# EAGLE design Esquema20 - Final (EAGLE 9.4.2)
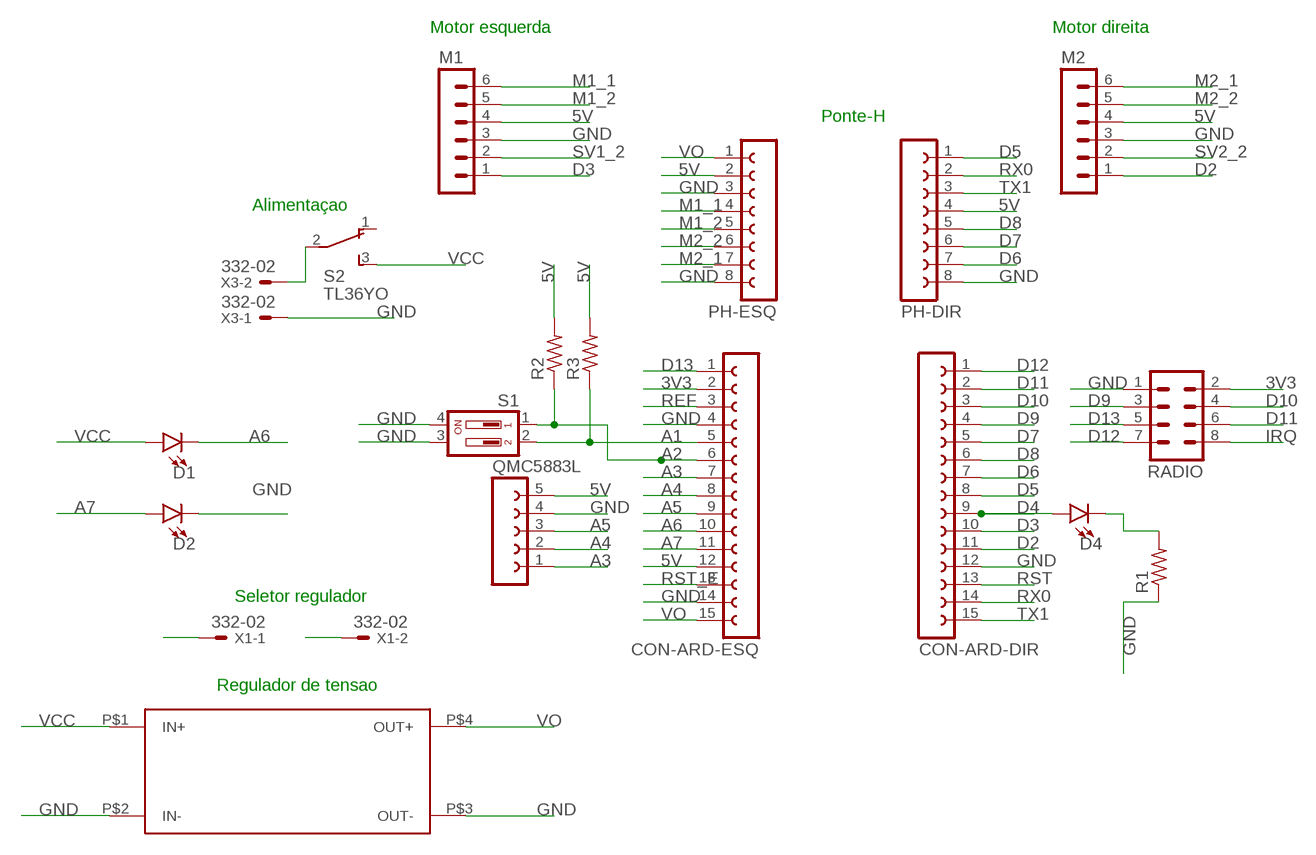
[diagram p0: schematic, sheet 1]

## Parts
CON-ARD-DIR  FE15-1  [FE15]
CON-ARD-ESQ  FE15-1  [FE15]
D1  LED-3MM-NO_SILK  [LED_3MM-NS]
D2  LED-3MM-NO_SILK  [LED_3MM-NS]
D4  LED-3MM-NO_SILK  [LED_3MM-NS]
M1  MA06-1  [MA06-1]
M2  MA06-1  [MA06-1]
PH-DIR  FE08-1  [FE08]
PH-ESQ  FE08-1  [FE08]
QMC5883L  FE05W  [FE05W]
R1  R-US_0207/12  [0207/12]
R2  R-US_0207/12  [0207/12]
R3  R-US_0207/12  [0207/12]
RADIO  MA04-2  [MA04-2]
S1  DA02  [DA-02]
S2  TL36YO  [TL3XYO]
U$1  REGULADOR  [REGULADOR-FP]
X1  332-02  [332-02]
X3  332-02  [332-02]

## Nets
3V3: CON-ARD-ESQ.2 RADIO.2
5V: CON-ARD-ESQ.12 M1.4 M2.4 PH-DIR.4 PH-ESQ.2 QMC5883L.5 R2.2 R3.2
A1: CON-ARD-ESQ.5 R3.1 S1.2
A2: CON-ARD-ESQ.6 R2.1 S1.1
A3: CON-ARD-ESQ.7 QMC5883L.1
A4: CON-ARD-ESQ.8 QMC5883L.2
A5: CON-ARD-ESQ.9 QMC5883L.3
A6: CON-ARD-ESQ.10 D1.K(C)
A7: CON-ARD-ESQ.11 D2.A
D2: CON-ARD-DIR.11 M2.1
D3: CON-ARD-DIR.10 M1.1
D4: CON-ARD-DIR.9 D4.A
D5: CON-ARD-DIR.8 PH-DIR.1
D6: CON-ARD-DIR.7 PH-DIR.7
D7: CON-ARD-DIR.5 PH-DIR.6
D8: CON-ARD-DIR.6 PH-DIR.5
D9: CON-ARD-DIR.4 RADIO.3
D10: CON-ARD-DIR.3 RADIO.4
D11: CON-ARD-DIR.2 RADIO.6
D12: CON-ARD-DIR.1 RADIO.7
D13: CON-ARD-ESQ.1 RADIO.5
GND: CON-ARD-DIR.12 CON-ARD-ESQ.4 CON-ARD-ESQ.14 D2.K(C) M1.3 M2.3 PH-DIR.8 PH-ESQ.3 PH-ESQ.8 QMC5883L.4 R1.1 RADIO.1 S1.3 S1.4 U$1.P$2(IN-) U$1.P$3(OUT-) X3.1
IRQ: RADIO.8
M1_1: M1.6 PH-ESQ.4
M1_2: M1.5 PH-ESQ.5
M2_1: M2.6 PH-ESQ.7
M2_2: M2.5 PH-ESQ.6
N$1: S2.2(P) X3.2
N$5: D4.K(C) R1.2
REF: CON-ARD-ESQ.3
RST: CON-ARD-DIR.13
RST_E: CON-ARD-ESQ.13
RX0: CON-ARD-DIR.14 PH-DIR.2
SV1_2: M1.2
SV2_2: M2.2
TX1: CON-ARD-DIR.15 PH-DIR.3
VCC [VCC]: D1.A S2.3(S) U$1.P$1(IN+) X1.1
VO: CON-ARD-ESQ.15 PH-ESQ.1 U$1.P$4(OUT+) X1.2
Unconnected: S2.1(O)

## Notes on the sheet
- Motor esquerda | Motor direita
- Ponte-H
- Alimentaçao
- Seletor regulador
- Regulador de tensao

## Library data of the parts
CON-ARD-DIR = con-lsta:FE15-1: FEMALE HEADER; OC_FARNELL: unknown; OC_NEWARK: unknown
CON-ARD-ESQ = con-lsta:FE15-1: FEMALE HEADER; OC_FARNELL: unknown; OC_NEWARK: unknown; SPICEPREFIX: X
D1 D2 D4 = SparkFun-LED:LED: LED (Generic) Standard schematic elements and footprints for 5mm, 3mm, 1206, and 0603 sized LEDs. Generic LEDs with no color specified.
M1 M2 = con-lstb:MA06-1: PIN HEADER; OC_FARNELL: unknown; OC_NEWARK: unknown
PH-DIR PH-ESQ = con-lsta:FE08-1: FEMALE HEADER; OC_FARNELL: unknown; OC_NEWARK: unknown
QMC5883L = con-lsta:FE05W: FEMALE HEADER; OC_FARNELL: unknown; OC_NEWARK: unknown
R1-R3 = resistor:R-US_: RESISTOR, American symbol
RADIO = con-lstb:MA04-2: PIN HEADER; OC_FARNELL: unknown; OC_NEWARK: unknown
S1 = switch-dil:DA02: DIL/CODE SWITCH; OC_FARNELL: 1255229; OC_NEWARK: unknown
S2 = switch:TL36YO: TINY SWITCH ON - ON Source: http://www2.produktinfo.conrad.com/datenblaetter/700000-724999/705152-da-01-de-Subminiaturschalter_TL_36YO.pdf
U$1 = robo-bdp:REGULADOR
X1 X3 = con-garry:332-02: 2 Pin - 2mm Dual Row Source: www.mpe-connector.de / garry_shortform_2012.pdf

## Net classes
0 default: width 1 mm
1 VCC: width 1 mm

## Board
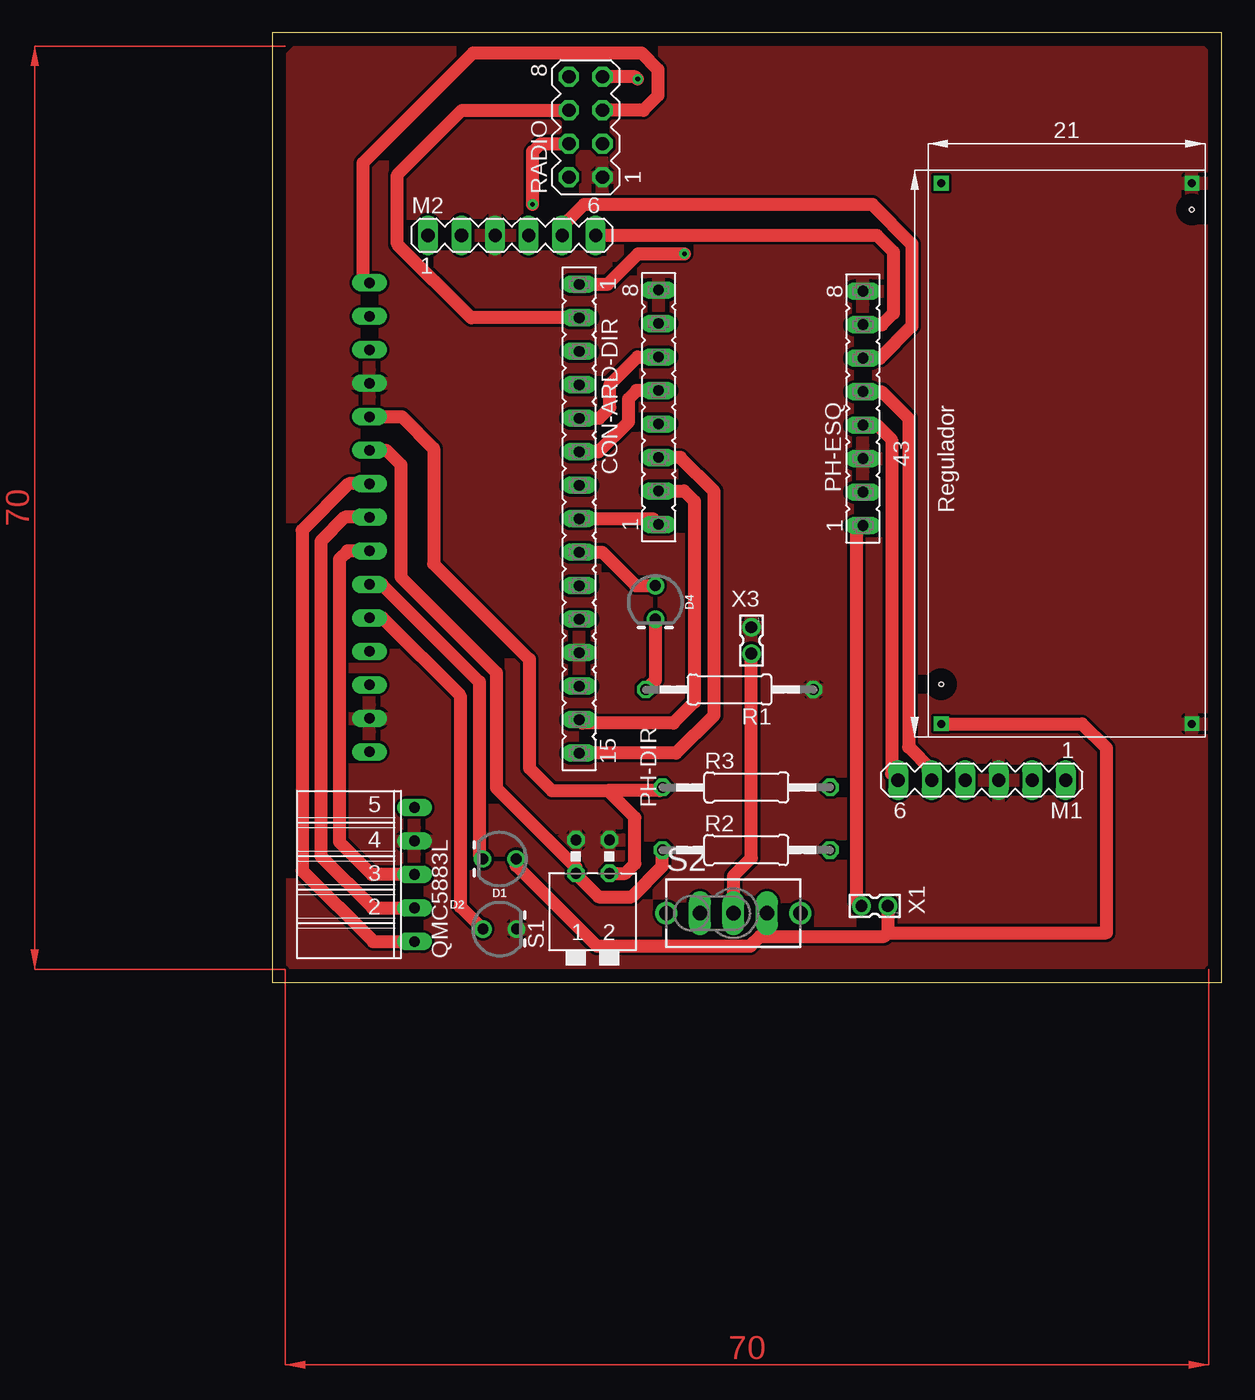
[diagram p1: board, top side]
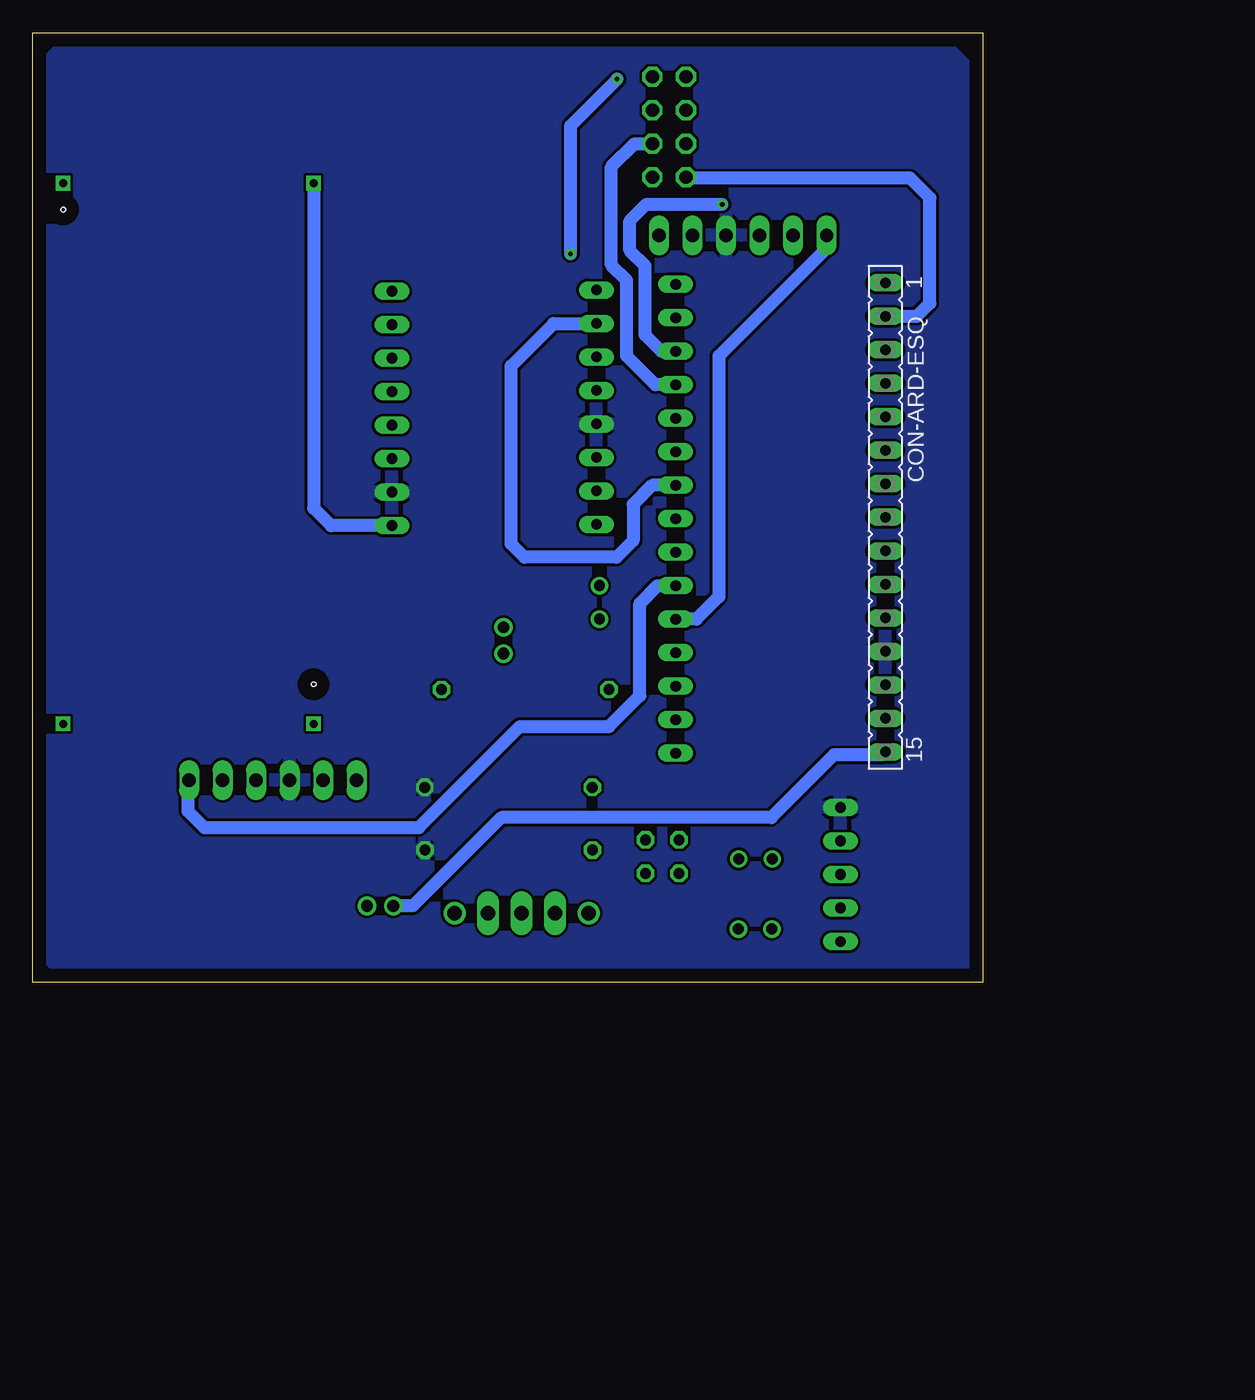
[diagram p2: board, bottom side, seen from below]

Size 72 x 72 mm. Coordinates in mm from the lower left corner, seen from the top.
Outline: 0,0 72,0 72,72 0,72 0,0
Copper layers (1*16): Top 0.035mm / dielectric 1.5mm / Bottom 0.035mm
Design rules "default *": minimum track width 6mil, minimum drill 0.35mm, track to track 8mil, track to pad 4mil, pad to pad 4mil, via to via 4mil, smd to smd 4mil, copper to edge 40mil, drill to drill 6mil, minimum pad ring 10mil, minimum via ring 8mil, stop-mask expansion 4mil, vias tented up to drill 0mil, thermal gap 10mil

### Footprints (pad centres in the part's own frame; a part is rotated, then mirrored left to right if it is on the bottom)
FE15 = drill 0.813 long: 1 -17.78,0; 2 -15.24,0; 3 -12.7,0; 4 -10.16,0; 5 -7.62,0; 6 -5.08,0; 7 -2.54,0; 8 0,0; 9 2.54,0; 10 5.08,0; 11 7.62,0; 12 10.16,0; 13 12.7,0; 14 15.24,0; 15 17.78,0
LED_3MM-NS = drill 0.813: A -1.27,0; K 1.27,0
MA06-1 = drill 1.016 long: 1 -6.35,0; 2 -3.81,0; 3 -1.27,0; 4 1.27,0; 5 3.81,0; 6 6.35,0
FE08 = drill 0.813 long: 1 -8.89,0; 2 -6.35,0; 3 -3.81,0; 4 -1.27,0; 5 1.27,0; 6 3.81,0; 7 6.35,0; 8 8.89,0
FE05W = drill 0.813 long: 1 -5.08,0; 2 -2.54,0; 3 0,0; 4 2.54,0; 5 5.08,0
0207/12 = drill 0.813 octagon: 1 -6.35,0; 2 6.35,0
MA04-2 = drill 1.016 octagon: 1 -3.81,-1.27; 2 -3.81,1.27; 3 -1.27,-1.27; 4 -1.27,1.27; 5 1.27,-1.27; 6 1.27,1.27; 7 3.81,-1.27; 8 3.81,1.27
DA-02 = drill 0.813 octagon: 1 -1.27,-1.27; 2 1.27,-1.27; 3 1.27,1.27; 4 -1.27,1.27
TL3XYO = drill 1.1 pad 1.422 long: 1 -2.54,0; 2 0,0; 3 2.54,0 | drill 1.1 pad 1.676: M1 -5.08,0; M2 5.08,0
REGULADOR-FP = drill 0.6 square: P$1 -19,3; P$2 -19,-16; P$3 22,-16; P$4 22,3 | hole 0.35: -16,3; 20,-16
332-02 = drill 0.9 pad 1.27: 1 0,-1; 2 0,1

### Placement (x,y rotation side)
CON-ARD-DIR  23.28,35.16 270 top
CON-ARD-ESQ  7.38,35.27 270 bottom
D1  17.23,9.36 180 top
D2  17.26,4.05 0 top
D4  29.05,28.82 270 top
M1  53.81,15.34 180 top
M2  18.18,56.66 0 top
PH-DIR  29.29,43.62 90 top
PH-ESQ  44.79,43.53 90 top
QMC5883L  10.79,8.18 90 top
R1  34.68,22.21 180 top
R2  35.94,10.04 0 top
R3  35.95,14.79 0 top
RADIO  23.77,64.87 90 top
S1  24.3,9.54 0 top
S2  34.96,5.25 0 top
U$1  53.72,38.61 90 top
X1  45.68,5.8 90 top
X3  36.33,25.93 180 top

### Tracks (layer width: path | path; a pad name or v marks a point on that pad's centre or on a via)
3V3
  Bottom 1: CON-ARD-ESQ.2 4.99,50.51 4,51.5 4,59.5 5.5,61 22.44,61 RADIO.2
5V
  pour Bottom: 1,1 70,1 70.75,1.75 70.75,70 70,70.75 2.5,70.75 1.25,69.5 1.25,1.5 1,1.5
A1
  Top 1: CON-ARD-ESQ.5 9.86,42.89 12.25,40.5 12.25,31.74 19.5,24.49 19.5,16.25 21.21,14.54 25.46,14.54 | S1.2 26.77,8.27 27.5,9 27.5,12.5 25.46,14.54 | R3.1 29.35,14.54 25.46,14.54
A2
  Top 1: CON-ARD-ESQ.6 8.65,40.35 9.75,39.25 9.75,30.75 17,23.5 17,14.75 23.03,8.72 S1.1 23.03,8.22 24.75,6.5 27.25,6.5 29.59,8.84 R2.1
A3
  Top 1: CON-ARD-ESQ.7 5.81,37.81 2.28,34.28 2.28,8.47 7.65,3.1 QMC5883L.1
A4
  Top 1: CON-ARD-ESQ.8 5.52,35.27 3.69,33.44 3.69,9.56 7.61,5.64 QMC5883L.2
A5
  Top 1: CON-ARD-ESQ.9 5.73,32.73 5.09,32.09 5.09,10.66 7.57,8.18 QMC5883L.3
A6
  Top 1: D1.K 15.71,9.61 15.71,22.79 8.31,30.19 CON-ARD-ESQ.10
A7
  Top 1: CON-ARD-ESQ.11 8.35,27.65 14.25,21.75 14.25,5.75 15.95,4.05 D2.A
D2
  Bottom 1: M2.1 11.83,55.67 20,47.5 20,29.25 21.71,27.54 CON-ARD-DIR.11
D3
  Bottom 1: M1.1 60.25,15.25 60.25,13 59,11.75 42.74,11.75 35.08,19.41 28.34,19.41 26,21.75 26,28.75 24.67,30.08 CON-ARD-DIR.10
D4
  Top 1: CON-ARD-DIR.9 25.02,32.62 27.55,30.09 D4.A
D5
  Top 1: CON-ARD-DIR.8 28.86,35.16 PH-DIR.1
D6
  Bottom 1: CON-ARD-DIR.7 25.05,37.7 26.5,36.25 26.5,33.5 27.75,32.25 34.75,32.25 35.75,33.25 35.75,46.75 32.53,49.97 PH-DIR.7
D7
  Top 1: CON-ARD-DIR.5 24.78,42.78 25.59,43.59 25.59,45.34 27.68,47.43 PH-DIR.6
D8
  Top 1: PH-DIR.5 27.64,44.89 27,44.25 27,42.5 24.74,40.24 CON-ARD-DIR.6
D9
  Bottom 1: CON-ARD-DIR.4 24.82,45.32 27,47.5 27,53.25 28.16,54.41 28.16,61.84 26.4,63.6 RADIO.3
D10  (via drill 0.35)
  Top 1: v19.75,59 19.75,63 20.35,63.6 RADIO.4
  Bottom 1: CON-ARD-DIR.3 24.36,47.86 25.59,49.09 25.59,54.34 26.75,55.5 26.75,57.75 25.5,59 v19.75,59
D11
  Top 1: CON-ARD-DIR.2 15.1,50.4 9.5,56 9.5,61.25 14.39,66.14 RADIO.6
D12  (via drill 0.35)
  Top 1: CON-ARD-DIR.1 25.44,52.94 27.75,55.25 v31.25,55.25 | v27.71,68.5 27.54,68.68 RADIO.7
  Bottom 1: v31.25,55.25 31.25,64.97 v27.71,68.5
D13
  Top 1: CON-ARD-ESQ.1 6.88,53.55 6.88,62.13 15.23,70.48 28.02,70.48 29.25,69.25 29.25,67.25 28.14,66.14 RADIO.5
GND
  pour Top: 1,1 70.5,1 71,1.5 71,70 70.25,70.75 2,70.75 0.75,69.5 0.75,1.25
M1_1
  Top 1: M1.6 46.96,15.84 46.96,41.16 45.86,42.26 PH-ESQ.4
M1_2
  Top 1: PH-ESQ.5 46.2,44.8 48.25,42.75 48.25,17.84 50,16.09 M1.5
M2_1
  Top 1: M2.6 45.84,56.66 47.09,55.41 47.09,50.75 46.22,49.88 PH-ESQ.7
M2_2
  Top 1: M2.5 21.99,57.35 23.64,59 45.5,59 48.5,56 48.5,49.75 46.09,47.34 PH-ESQ.6
N$1
  Top 1: S2.2 34.96,8.06 36.33,9.43 X3.2
N$5
  Top 1: D4.K 29.05,22.93 R1.2
RX0
  Top 1: PH-DIR.2 31.23,37.27 32,36.5 32,21.25 30.42,19.67 23.53,19.67 CON-ARD-DIR.14
TX1
  Top 1: CON-ARD-DIR.15 30.63,17.38 33.5,20.25 33.5,37.25 30.94,39.81 PH-DIR.3
VCC
  Top 1: U$1.P$1 61.39,19.61 63.23,17.77 63.23,3.77 46.68,3.77 | X1.1 46.68,3.77 | 37,3.5 36.25,2.75 24.61,2.75 18.5,8.86 D1.A | 37,3.5 37.5,4 S2.3 | 37,3.5 46.41,3.5 46.68,3.77
VO
  Top 1: PH-ESQ.1 44.29,34.14 44.29,6.19 X1.2
  Bottom 1: CON-ARD-ESQ.15 7.62,17.25 11.28,17.25 16.03,12.5 36.5,12.5 43.2,5.8 X1.2 | PH-ESQ.1 49.39,34.64 50.72,35.97 U$1.P$4
(copper drawn outside any net)
  shapes: Top area x2